# Altium schematic sheet pca20020_sheet7_sound_and_light.SchDoc: PCA20020 - Sound and Light
size A4; DocumentNumber: 7; Revision: 1.0.0; SheetNumber: 7; SheetTotal: 9; DrawnBy: RUBR; PCBRevision: 0264RUBR; DocumentSize: A4; PCAName: PCA20020; PCBNumber: 400182
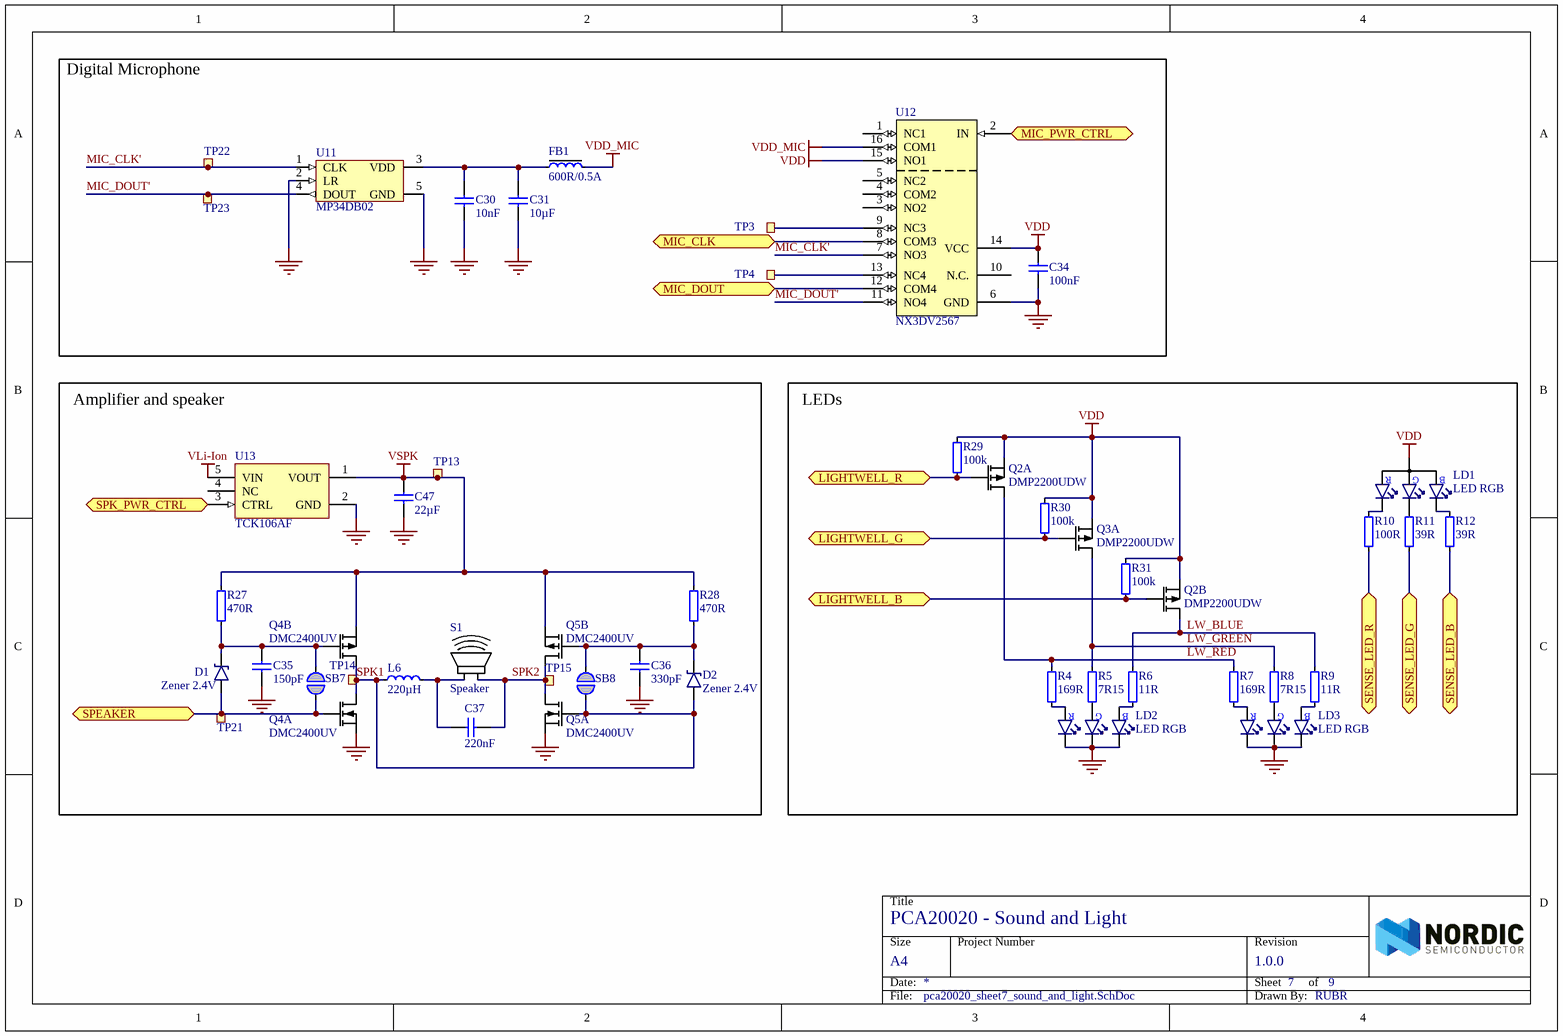
[diagram p0: pca20020_sheet7_sound_and_light.SchDoc]

## Parts
C30  10nF  [CAPC1005X04L]
C31  10µF  [CAPC1608X06L]
C34  100nF  [CAPC1005X04L]
C35  150pF  [CAPC1005X04L]
C36  330pF  [CAPC1005X04L]
C37  220nF  [CAPC1005X04L]
C47  22µF  [CAPC1608X06L]
D1  Zener 2.4V  [SOD-523]
D2  Zener 2.4V  [SOD-523]
FB1  600R/0.5A  [INDC1608X06L]
L6  220µH  [INDP4040X25N]
LD1  LED RGB  [LED_RGB_0606]
LD2  LED RGB  [MSL0104]
LD3  LED RGB  [MSL0104]
Q2  DMP2200UDW  [SOT-363]  (parts A,B of 2)
Q3  DMP2200UDW  [SOT-363]  (part A of 2)
Q4  DMC2400UV  [SOTFL50P162X60-6N]  (parts A,B of 2)
Q5  DMC2400UV  [SOTFL50P162X60-6N]  (parts A,B of 2)
R4  169R  [RESC1005X04L]
R5  7R15  [RESC1005X04L]
R6  11R  [RESC1005X04L]
R7  169R  [RESC1005X04L]
R8  7R15  [RESC1005X04L]
R9  11R  [RESC1005X04L]
R10  100R  [RESC1005X04L]
R11  39R  [RESC1005X04L]
R12  39R  [RESC1005X04L]
R27  470R  [RESC1005X04L]
R28  470R  [RESC1005X04L]
R29  100k  [RESC1005X04L]
R30  100k  [RESC1005X04L]
R31  100k  [RESC1005X04L]
S1  Speaker  [Speaker 15x11x3mm]  (no BOM)
SB7  Solderbridge  [Solderbridge]  (value not drawn)  (no BOM)
SB8  Solderbridge  [Solderbridge]  (value not drawn)  (no BOM)
TP3  TP  [TESTPAD-TH]  (value not drawn)  (no BOM)
TP4  TP  [TESTPAD-TH]  (value not drawn)  (no BOM)
TP13  Ø1.5mm,SMD  [TP_SMD_Ø1.5mm]  (value not drawn)  (no BOM)
TP14  Ø1.5mm,SMD  [TP_SMD_Ø1.5mm]  (value not drawn)  (no BOM)
TP15  Ø1.5mm,SMD  [TP_SMD_Ø1.5mm]  (value not drawn)  (no BOM)
TP21  Ø1.5mm,SMD  [TP_SMD_Ø1.5mm]  (value not drawn)  (no BOM)
TP22  Ø1.5mm,SMD  [TP_SMD_Ø1.5mm]  (value not drawn)  (no BOM)
TP23  Ø1.5mm,SMD  [TP_SMD_Ø1.5mm]  (value not drawn)  (no BOM)
U11  MP34DB02  [RHLGA-4 (3x4x1mm)]
U12  NX3DV2567  [XQFN40P180X260X50-16N]
U13  TCK106AF  [SOT95P280X140-5N]

## Blocks framed on the sheet
Digital Microphone: C30 C31 C34 FB1 TP3 TP4 TP22 TP23 U11 U12
Amplifier and speaker: C35-C37 C47 D1 D2 L6 Q4 Q5 R27 R28 S1 SB7 SB8 TP13-TP15 TP21 U13
LEDs: LD1-LD3 Q2 Q3 R4-R12 R29-R31

## Ports
LIGHTWELL_B (bidir), LIGHTWELL_G (bidir), LIGHTWELL_R (bidir), MIC_CLK (bidir), MIC_DOUT (bidir), MIC_PWR_CTRL (bidir), SENSE_LED_B (bidir), SENSE_LED_G (bidir), SENSE_LED_R (bidir), SPEAKER (bidir), SPK_PWR_CTRL (bidir)

## Nets
GND: C30.1 C31.1 C34.1 C35.1 C36.1 C47.1 LD2.3(C_GREEN) LD2.4(C_RED) LD2.5(C_BLUE) LD3.3(C_GREEN) LD3.4(C_RED) LD3.5(C_BLUE) Q4.1(S1) Q5.1(S1) U11.2(LR) U11.5(GND) U12.6(GND) U13.2(GND)
VDD: C34.2 LD1.4(A) Q2.1(S1) Q2.4(S2) Q3.1(S1) R29.1 R30.1 R31.1 U12.14(VCC) U12.15(NO1)
VDD_MIC: FB1.2 U12.16(COM1)
VLi-Ion: U13.5(VIN)
VSPK: C47.2 Q4.4(S2) Q5.4(S2) R27.1 R28.1 TP13.1 U13.1(VOUT)
LIGHTWELL_B: Q2.5(G2) R31.2 ; port LIGHTWELL_B
LIGHTWELL_G: Q3.2(G1) R30.2 ; port LIGHTWELL_G
LIGHTWELL_R: Q2.2(G1) R29.2 ; port LIGHTWELL_R
LW_BLUE: Q2.3(D2) R6.1 R9.1
LW_GREEN: Q3.6(D1) R5.1 R8.1
LW_RED: Q2.6(D1) R4.1 R7.1
MIC_CLK: U12.8(COM3) ; port MIC_CLK
MIC_CLK': TP22.1 U11.1(CLK) U12.7(NO3)
MIC_DOUT: U12.12(COM4) ; port MIC_DOUT
MIC_DOUT': TP23.1 U11.4(DOUT) U12.11(NO4)
MIC_PWR_CTRL: U12.2(IN) ; port MIC_PWR_CTRL
SENSE_LED_B: R12.1 ; port SENSE_LED_B
SENSE_LED_G: R11.1 ; port SENSE_LED_G
SENSE_LED_R: R10.1 ; port SENSE_LED_R
SPEAKER: D1.1(A) Q4.2(G1) SB7.2 TP21.1 ; port SPEAKER
SPK1: D2.1(A) L6.1 Q4.3(D2) Q4.6(D1) Q5.2(G1) SB8.2 TP14.1
SPK2: C37.1 Q5.3(D2) Q5.6(D1) S1.2 TP15.1
SPK_PWR_CTRL: U13.3(CTRL) ; port SPK_PWR_CTRL
NetC30_2: C30.2 C31.2 FB1.1 U11.3(VDD)
NetC35_2: C35.2 D1.3(C) Q4.5(G2) R27.2 SB7.1
NetC36_2: C36.2 D2.3(C) Q5.5(G2) R28.2 SB8.1
NetC37_2: C37.2 L6.2 S1.1
NetLD1_1: LD1.1(C_RED) R10.2
NetLD1_2: LD1.2(C_GREEN) R11.2
NetLD1_3: LD1.3(C_BLUE) R12.2
NetLD2_1: LD2.1(A_RED) R4.2
NetLD2_2: LD2.2(A_GREEN) R5.2
NetLD2_6: LD2.6(A_BLUE) R6.2
NetLD3_1: LD3.1(A_RED) R7.2
NetLD3_2: LD3.2(A_GREEN) R8.2
NetLD3_6: LD3.6(A_BLUE) R9.2
NetTP3_1: TP3.1 U12.9(NC3)
NetTP4_1: TP4.1 U12.13(NC4)

Not connected (* = marked no-connect by the designer): U12 1(NC1) 3(NO2) 4(COM2) 5(NC2) 10(N.C.); U13 4(NC)

## Notes on the sheet
- Title
- Size
- Date:
- Project Number
- Sheet         of
- Revision
- File:
- Drawn By:
- (in symbol LTST-C19HE1WT) R; G; B
- (in symbol MSL0104RGBU1) R; G; B

## Library data of the parts
C30 = C0402-10n: Capacitor, X7R, ±10%; Part number IPS: 00000007784; Note: 16V; Artikkelnr Noca: 20039166; Artikkelnr Simpro: N.A.; Part Number: C0402-10n; Manufacturer: *; Manufacturer Part Number: *; Datasheet: *; LatestRevisionDate: 2009-11-23; Pin Count: 2; Publisher: Nordic Semiconductor; Published: 2009-05-08; Value: 10nF; Supplier: *; Supplier part number: *; 2nd source Supplier: *; 2nd source part number: *; Footprint Doc: 0402
C31 = C0603-10µ: Capacitor, X5R, ±20%; Part number IPS: 00000007785; Note: 6.3V; Artikkelnr Noca: 20039234; Artikkelnr Simpro: N.A.; Part Number: C0603-10µ; Manufacturer: *; Manufacturer Part Number: *; Datasheet: *; LatestRevisionDate: 2011-01-17; Pin Count: 2; Publisher: Nordic Semiconductor; Published: 2011-01-17; Value: 10µF; Supplier: *; Supplier part number: *; 2nd source Supplier: *; 2nd source part number: *; Footprint Doc: 0603
C34 = C0402-100n: Capacitor, X7R, ±10%; Part number IPS: 00000005296; Note: 16V; Artikkelnr Noca: 20039200; Artikkelnr Simpro: N.A.; Part Number: C0402-100n; Manufacturer: *; Manufacturer Part Number: *; Datasheet: *; Footprint Doc: 0402; LatestRevisionDate: 2009-11-23; Pin Count: 2; Publisher: Nordic Semiconductor; Published: 2009-05-08; Value: 100nF; Supplier: *; Supplier part number: *; 2nd source Supplier: *; 2nd source part number: *
C35 = C0402-150p: Capacitor, NP0, ±5%; Part number IPS: 00000007972; Note: 50V; Artikkelnr Noca: 20029111; Artikkelnr Simpro: N.A.; Part Number: C0402-150p; Manufacturer: *; Manufacturer Part Number: *; Datasheet: *; Footprint Doc: 0402; LatestRevisionDate: 2009-05-08; Pin Count: 2; Publisher: Nordic Semiconductor; Published: 2009-05-08; Value: 150pF; Supplier: *; Supplier part number: *; 2nd source Supplier: *; 2nd source part number: *
C36 = C0402-330p: Capacitor, NP0, ±5%; Part number IPS: 00000006576; Note: 50V; Artikkelnr Noca: N.A.; Part Number: C0402-330p; Manufacturer: *; Manufacturer Part Number: *; Datasheet: *; Footprint Doc: 0402; LatestRevisionDate: 2017-02-02; Pin Count: 2; Publisher: Nordic Semiconductor; Published: 2009-05-08; Value: 330pF; Supplier: *; Supplier part number: *; 2nd source Supplier: *; 2nd source part number: *; Artikkelnr Simpro: N.A.
C37 = C0402-220n: Capacitor, X7R, ±10%; Part number IPS: 00000006793; Note: 16V; Artikkelnr Noca: N.A.; Part Number: C0402-220n; Manufacturer: *; Manufacturer Part Number: *; Datasheet: *; Footprint Doc: 0402; LatestRevisionDate: 2009-05-08; Pin Count: 2; Publisher: Nordic Semiconductor; Published: 2009-05-08; Value: 220nF; Supplier: *; Supplier part number: *; 2nd source Supplier: *; 2nd source part number: *; Artikkelnr Simpro: N.A.
C47 = C0603-22µ-6.3V: CAP CER 22UF 6.3V 20% X5R 0603; Manufacturer: Samsung; Manufacturer Part Number: CL10A226MQ8NRNC; Part number IPS: 00000007787; Artikkelnr Noca: N.A.; Part Number: C0603-22µ-6.3V; Datasheet: http://www.samsungsem.com/kr/front/downloadcms.do?path=/kr/support/product-search/mlcc/__icsFiles/afieldfile/2014/11/05&fileName=S_CL10A226MQ8NRNC.pdf; Footprint Doc: 0603; LatestRevisionDate: 2015-04-10; Pin Count: 2; Publisher: Nordic Semiconductor; Published: 2015-04-10; Value: 22µF; Note: 6.3V; Supplier: Digi-Key; Supplier part number: 1276-1193-1-ND; 2nd source Supplier: *; 2nd source part number: *; Artikkelnr Simpro: N.A.
D1 D2 = BZT52C2V4T: Diode, Zener, 2.4V, 0.3W; Manufacturer: Diodes Incorporated; Part number IPS: 00000007974; Artikkelnr Noca: N.A.; Part Number: BZT52C2V4T; Manufacturer Part Number: BZT52C2V4T; Datasheet: http://www.diodes.com/_files/datasheets/ds30502.pdf; Footprint Doc: SOD-523; LatestRevisionDate: 2017-01-25; Publisher: Nordic Semiconductor; Published: 2017-01-25; Value: Zener 2.4V; Note: *; Supplier: Digi-Key; Supplier part number: BZT52C2V4T-7DICT-ND; 2nd source Supplier: *; 2nd source part number: *; Artikkelnr Simpro: N.A.; Pin Count: 2
FB1 = FB0603-600R@100MHz-500mA: Ferrite Bead, 600 Ohm @ 100MHz, 500mA, 380 mOhm Max; Manufacturer: Murata; Manufacturer Part Number: BLM18AG601SN1; 2nd source part number: 490-1014-1-ND; Part number IPS: 00000007789; Note: Chip EMIFIL Inductor Type Chip Ferrite Bead; Artikkelnr Noca: 37019100; Artikkelnr Simpro: N.A.; Part Number: FB0603-600R@100MHz-500mA; Datasheet: http://www.farnell.com/datasheets/356366.pdf; Footprint Doc: 0603; LatestRevisionDate: 2014-01-10; Pin Count: 2; Publisher: Nordic Semiconductor; Published: 2010-09-02; Value: 600R/0.5A; Supplier: Farnell; Supplier part number: 151-5679; 2nd source Supplier: Digi-Key; ComponentLink1Description: Datasheet; ComponentLink2Description: Supplier link
L6 = L4040-220µ: Inductor, ±20%, 200mA, 2.76 Ohm; Manufacturer: Bourns; Manufacturer Part Number: SRN4026-221M; Part number IPS: 00000007797; Note: -40°C ~ 125°C; Artikkelnr Noca: N:A; Artikkelnr Simpro: N.A.; Part Number: L4040-220µ; Datasheet: http://www.bourns.com/docs/Product-Datasheets/SRN4026.pdf; Footprint Doc: 4040; LatestRevisionDate: 2016-01-18; Pin Count: 2; Publisher: Nordic Semiconductor; Published: 2016-01-18; Value: 220µH; Supplier: Digi-Key; Supplier part number: SRN4026-221MCT-ND; 2nd source Supplier: *; 2nd source part number: *; ComponentLink1Description: Datasheet; ComponentLink2Description: Supplier link
LD1 = LTST-C19HE1WT: RGB LED 1.60 mm x 1.60 mm SMD; Manufacturer: Lite-On Inc; 2nd source part number: 859-LTST-C19HE1WT; Part number IPS: 00000007798; Artikkelnr Noca: N.A.; Part Number: LTST-C19HE1WT; Manufacturer Part Number: LTST-C19HE1WT; Datasheet: http://optoelectronics.liteon.com/upload/download/DS22-2008-0044/S_110_LTST-C19HE1WT.pdf; LatestRevisionDate: 2016-09-23; Pin Count: 4; Publisher: Nordic Semiconductor; Published: 2016-09-23; Value: LED RGB; Note: *; Supplier: Digi-Key; Supplier part number: 160-2162-1-ND; 2nd source Supplier: Mouser; Footprint Doc: LED_RGB_0606; Artikkelnr Simpro: N.A.
LD2 LD3 = MSL0104RGBU1: High brightness, side view RGB LED; Manufacturer: ROHM; 2nd source part number: 755-MSL0104RGBU1; Part number IPS: 00000007799; Artikkelnr Noca: N.A.; Part Number: MSL0104RGBU1; Manufacturer Part Number: MSL0104RGBU1; Datasheet: http://www.rohm.com/web/eu/datasheet/MSL0104RGBU; LatestRevisionDate: 2016-09-21; Pin Count: 7; Publisher: Nordic Semiconductor; Published: 2016-09-21; Value: LED RGB; Note: *; Supplier: Digi-Key; Supplier part number: MSL0104RGBU1CT-ND; 2nd source Supplier: Mouser; Footprint Doc: 6922; Artikkelnr Simpro: N.A.
Q2 Q3 = DMP2200UDW: Dual P Ch MOFET, 900mA, 260mOhm, 450mW; Manufacturer: Diodes Incorporated; Part number IPS: 00000007802; Note: Dual P Channel Digital FET; Artikkelnr Noca: N.A.; Part Number: DMP2200UDW; Manufacturer Part Number: DMP2200UDW; Datasheet: http://www.diodes.com/_files/datasheets/DMP2200UDW.pdf; Footprint Doc: SOT-363; LatestRevisionDate: 2016-11-08; Pin Count: 6; Publisher: Nordic Semiconductor; Published: 2016-11-08; Value: DMP2200UDW; Supplier: Digi-Key; Supplier part number: DMP2200UDW-7DICT-ND; 2nd source Supplier: *; 2nd source part number: *; Artikkelnr Simpro: N.A.
Q4 Q5 = DMC2400UV: Dual N & P Ch MOFET, 1.03A/0.7A, 480mOhm, 450mW; Manufacturer: Diodes Incorporated; Part number IPS: 00000007803; Note: Dual N & P Channel Digital FET; Artikkelnr Noca: N.A.; Part Number: DMC2400UV; Manufacturer Part Number: DMC2400UV; Datasheet: http://www.diodes.com/_files/datasheets/DMC2400UV.pdf; Footprint Doc: SOT-563; LatestRevisionDate: 2016-01-18; Pin Count: 6; Publisher: Nordic Semiconductor; Published: 2016-01-18; Value: DMC2400UV; Supplier: Digi-Key; Supplier part number: DMC2400UV-7DICT-ND; 2nd source Supplier: *; 2nd source part number: *; Artikkelnr Simpro: N.A.
R4 R7 = R0402-169: Resistor, ±1%, 0.063W; Part number IPS: 00000007805; Note: Chip Res 1%; Artikkelnr Noca: N.A.; Value Ohm: 169; Part Number: R0402-169; Manufacturer: *; Manufacturer Part Number: *; Datasheet: *; LatestRevisionDate: 2016-09-22; Pin Count: 2; Publisher: Nordic Semiconductor; Published: 2016-09-22; Value: 169R; Supplier: Digi-Key; Supplier part number: 541-169LCT-ND; 2nd source Supplier: *; 2nd source part number: *; Footprint Doc: 0402; Artikkelnr Simpro: N.A.
R5 R8 = R0402-7R15: Resistor, ±1%, 0.063W; Part number IPS: 00000007806; Note: Chip Res 1%; Artikkelnr Noca: N.A.; Value Ohm: 7.15; Part Number: R0402-7R15; Manufacturer: *; Manufacturer Part Number: *; Datasheet: *; LatestRevisionDate: 2016-09-22; Pin Count: 2; Publisher: Nordic Semiconductor; Published: 2016-09-22; Value: 7R15; Supplier: Digi-Key; Supplier part number: 541-7.15LLCT-ND; 2nd source Supplier: *; 2nd source part number: *; Footprint Doc: 0402; Artikkelnr Simpro: N.A.
R6 R9 = R0402-11R: Resistor, ±1%, 0.063W; Part number IPS: 00000007807; Note: Chip Res 1%; Artikkelnr Noca: N.A.; Value Ohm: 11; Part Number: R0402-11R; Manufacturer: *; Manufacturer Part Number: *; Datasheet: *; LatestRevisionDate: 2016-11-09; Pin Count: 2; Publisher: Nordic Semiconductor; Published: 2016-11-09; Value: 11R; Supplier: Farnell; Supplier part number: 214-0577; 2nd source Supplier: *; 2nd source part number: *; Footprint Doc: 0402; Artikkelnr Simpro: N.A.
R10 = R0402-100: Resistor, ±1%, 0.063W; Part number IPS: 00000002811; Note: Chip Res 1%; Artikkelnr Noca: 27049049; Artikkelnr Simpro: N.A.; Value Ohm: 100; Part Number: R0402-100; Manufacturer: *; Manufacturer Part Number: *; Datasheet: *; LatestRevisionDate: 2009-11-23; Pin Count: 2; Publisher: Nordic Semiconductor; Published: 2009-05-08; Value: 100R; Supplier: Farnell; Supplier part number: 173-8837; 2nd source Supplier: *; 2nd source part number: *; Footprint Doc: 0402
R11 R12 = R0402-39R: Resistor, ±1%, 0.063W; Part number IPS: 00000000821; Note: Chip Res 1%; Artikkelnr Noca: 27049039; Artikkelnr Simpro: N.A.; Value Ohm: 39; Part Number: R0402-39R; Manufacturer: *; Manufacturer Part Number: *; Datasheet: *; LatestRevisionDate: 2009-11-23; Pin Count: 2; Publisher: Nordic Semiconductor; Published: 2009-05-08; Value: 39R; Supplier: Farnell; Supplier part number: 173-8831; 2nd source Supplier: *; 2nd source part number: *; Footprint Doc: 0402
R27 R28 = R0402-470: Resistor, ±1%, 0.063W; Part number IPS: 00000007975; Note: Chip Res 1%; Artikkelnr Noca: 27049065; Artikkelnr Simpro: N.A.; Value Ohm: 470; Part Number: R0402-470; Manufacturer: *; Manufacturer Part Number: *; Datasheet: *; LatestRevisionDate: 2009-11-23; Pin Count: 2; Publisher: Nordic Semiconductor; Published: 2009-05-08; Value: 470R; Supplier: Farnell; Supplier part number: 173-8845; 2nd source Supplier: *; 2nd source part number: *; Footprint Doc: 0402
R29-R31 = R0402-100k: Resistor, ±1%, 0.063W; Part number IPS: 00000003667; Note: Chip Res 1%; Artikkelnr Noca: 27049121; Artikkelnr Simpro: N.A.; Value Ohm: 100000; Part Number: R0402-100k; Manufacturer: *; Manufacturer Part Number: *; Datasheet: *; LatestRevisionDate: 2009-11-23; Pin Count: 2; Publisher: Nordic Semiconductor; Published: 2009-05-08; Value: 100k; Supplier: Farnell; Supplier part number: 173-8877; 2nd source Supplier: *; 2nd source part number: *; Footprint Doc: 0402
S1 = BMS1511F-11C-08H03P LF: Speaker, SMD, 15.0mm x 11.0mm x 3.0mm, 0Hz-20kHz, 89dB, 8 ohm, 0.7W; Manufacturer: BeStar; Artikkelnr Noca: N.A.; Part Number: BMS1511F-11C-08H03P LF; Manufacturer Part Number: BMS1511F-11C-08H03P LF; Datasheet: \\hizz\pro\app9717\Datasheet\speakers\bestar\BMS1511F-11C-08H03P LF.pdf; Footprint Doc: Speaker 15x11x3mm; LatestRevisionDate: 2016-09-15; Pin Count: 2; Publisher: Nordic Semiconductor; Published: 2016-09-15; Value: Speaker; Note: *; Supplier: *; Supplier part number: *; 2nd source Supplier: *; 2nd source part number: *; Artikkelnr Simpro: N.A.
SB7 SB8 = Solderbridge: Artikkelnr Noca: N.A.; Part Number: Solderbridge; Manufacturer: *; Manufacturer Part Number: *; Datasheet: *; Footprint Doc: Solderbridge; LatestRevisionDate: 2009-12-14; Pin Count: 2; Publisher: Nordic Semiconductor; Published: 2009-12-14; Value: Solderbridge; Note: *; Supplier: *; Supplier part number: *; 2nd source Supplier: *; 2nd source part number: *; Artikkelnr Simpro: N.A.
TP3 TP4 = Testpoint TH: Testpoint, through hole; Artikkelnr Noca: N.A.; Part Number: Testpoint TH; Manufacturer: *; Manufacturer Part Number: *; Datasheet: *; Footprint Doc: TESTPAD-TH; LatestRevisionDate: 2009-12-12; Pin Count: 1; Publisher: Nordic Semiconductor; Published: 2009-12-12; Value: TP; Note: *; Supplier: *; Supplier part number: *; 2nd source Supplier: *; 2nd source part number: *; Artikkelnr Simpro: N.A.
TP13-TP15 TP21-TP23 = TP_SMD_Ø1.5MM: 1.0mm circular SMD testpad; Manufacturer: Nordic Semiconductor; Artikkelnr Noca: N.A.; Part Number: TP_SMD_Ø1.5MM; Manufacturer Part Number: *; Datasheet: *; Footprint Doc: TP_SMD_Ø1.5mm; LatestRevisionDate: 2016-06-02; Pin Count: 1; Publisher: Nordic Semiconductor; Published: 2016-06-02; Value: Ø1.5mm,SMD; Note: *; Supplier: *; Supplier part number: *; 2nd source Supplier: *; 2nd source part number: *; Artikkelnr Simpro: N.A.
U11 = MP34DB02: MEMS audio sensor omnidirectional digital microphone; Manufacturer: STMicroelectronics; 2nd source part number: 511-MP34DB02TR; Part number IPS: 00000007822; Note: Alternative: ADMP421, SPK0833LM4H-B, MP34DB01; Artikkelnr Noca: N.A.; Part Number: MP34DB02; Manufacturer Part Number: MP34DB02; Datasheet: http://www.st.com/web/en/resource/technical/document/datasheet/DM00111225.pdf; LatestRevisionDate: 2015-11-11; Pin Count: 5; Publisher: Nordic Semiconductor; Published: 2015-11-11; Value: MP34DB02; Supplier: Digi-Key; Supplier part number: 497-15103-1-ND; 2nd source Supplier: Mouser; Footprint Doc: RHLGA-4; Artikkelnr Simpro: N.A.
U12 = NX3DV2567GU: Low-ohmic four-pole double-throw analog switch; Manufacturer: NXP Semiconductors; 2nd source part number: 771-NX3DV2567GU115; Part number IPS: 00000007816; Artikkelnr Noca: 15079317; Artikkelnr Simpro: N.A.; Part Number: NX3DV2567GU; Manufacturer Part Number: NX3DV2567GU; Datasheet: http://www.nxp.com/documents/data_sheet/NX3DV2567.pdf; Footprint Doc: XQFN-16; LatestRevisionDate: 2015-02-17; Pin Count: 16; Publisher: Nordic Semiconductor; Published: 2015-02-17; Value: NX3DV2567; Note: *; Supplier: Digi-Key; Supplier part number: 568-5206-1-ND; 2nd source Supplier: Mouser
U13 = TCK106AF,LF: 1.0 A Load Switch IC with Slew Rate Control Driver in Small Package; Manufacturer: Toshiba; Part number IPS: 00000007823; Artikkelnr Noca: 15070086; Artikkelnr Simpro: N.A.; Part Number: TCK106AF,LF; Manufacturer Part Number: TCK106AF,LF; Datasheet: https://toshiba.semicon-storage.com/info/docget.jsp?did=53240&prodName=TCK108AF; Footprint Doc: SOT-25; LatestRevisionDate: 2016-09-29; Pin Count: 5; Publisher: Nordic Semiconductor; Published: 2016-09-29; Value: TCK106AF; Note: *; Supplier: Digi-Key; Supplier part number: TCK106AFLFCT-ND; 2nd source Supplier: *; 2nd source part number: *